# Altium project VCO.PrjPcb
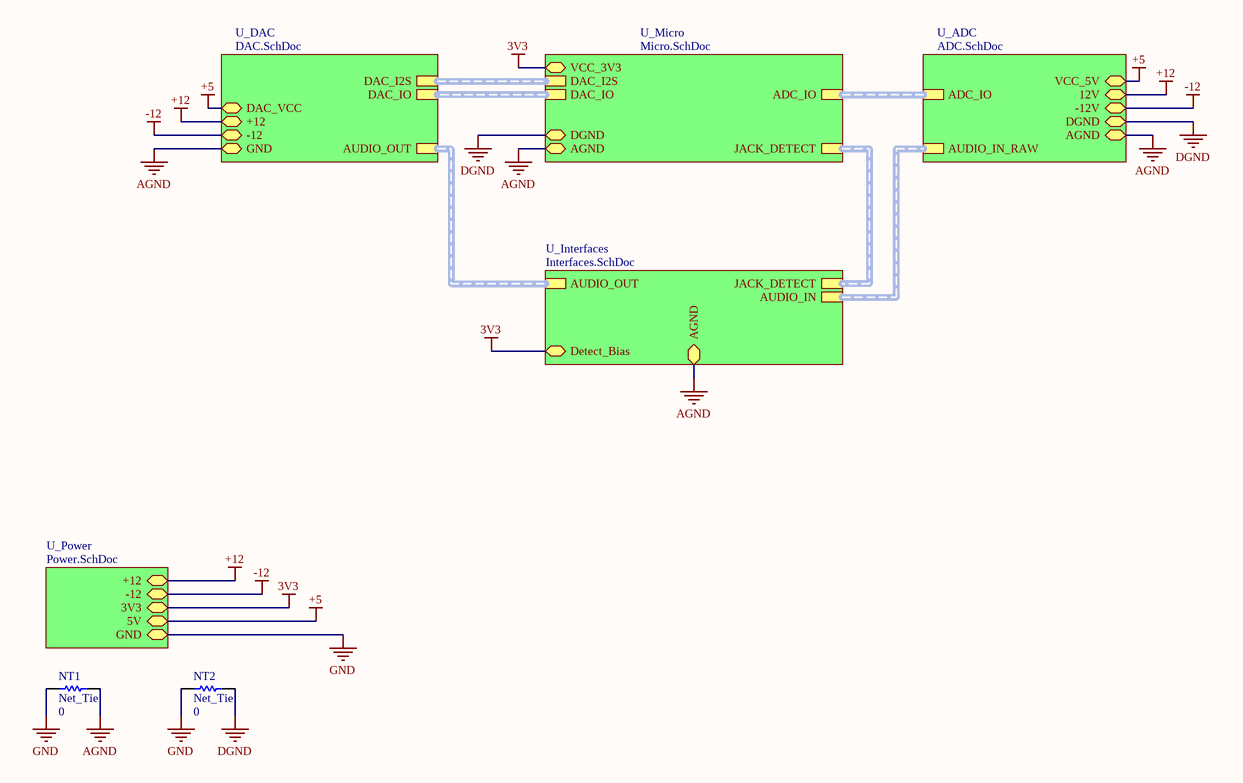
[diagram p0: VCO_TOP.SchDoc]
8 sheets, 148 parts. Net scope: strictly hierarchical (ports join the sheet entries above them; power ports are local).
Board file: VCO.PcbDoc
Sheets:
  VCO_TOP.SchDoc
    U_Power = Power.SchDoc
    U_Micro = Micro.SchDoc
    U_DAC = DAC.SchDoc
      U_Output_stages = Output_stages.SchDoc
    U_ADC = ADC.SchDoc
      U_Input_stages = Input_stages.SchDoc
    U_Interfaces = Interfaces.SchDoc

## Sheet VCO_TOP.SchDoc
size A4

### Parts
NT1  Net_Tie  value 0  [RES0603R]
NT2  Net_Tie  value 0  [RES0603R]

### Sub-sheets
U_ADC = ADC.SchDoc: AGND (bidir), VCC_5V (bidir), DGND (bidir), ADC_IO (harness ADC_IO), -12V (bidir), 12V (bidir), AUDIO_IN_RAW (harness AUDIO_IN)
U_DAC = DAC.SchDoc: DAC_I2S (harness DAC_I2S), DAC_VCC (bidir), GND (bidir), DAC_IO (harness DAC_IO), -12 (bidir), +12 (bidir), AUDIO_OUT (harness AUDIO_OUT)
U_Interfaces = Interfaces.SchDoc: AGND (bidir), Detect_Bias (bidir), JACK_DETECT (harness JACK_DETECT), AUDIO_OUT (harness AUDIO_OUT), AUDIO_IN (harness AUDIO_IN)
U_Micro = Micro.SchDoc: VCC_3V3 (bidir), DAC_I2S (harness DAC_I2S), DAC_IO (harness DAC_IO), JACK_DETECT (harness JACK_DETECT), ADC_IO (harness ADC_IO), DGND (bidir), AGND (bidir)
U_Power = Power.SchDoc: +12 (bidir), -12 (bidir), GND (bidir), 3V3 (bidir), 5V (bidir)

### Nets
3V3: sheet U_Power/3V3, sheet U_Micro/VCC_3V3, sheet U_Interfaces/Detect_Bias
+5: sheet U_Power/5V, sheet U_DAC/DAC_VCC, sheet U_ADC/VCC_5V
+12: sheet U_Power/+12, sheet U_DAC/+12, sheet U_ADC/12V
-12: sheet U_Power/-12, sheet U_DAC/-12, sheet U_ADC/-12V
AGND: NT1.2 ; sheet U_Micro/AGND, sheet U_DAC/GND, sheet U_ADC/AGND, sheet U_Interfaces/AGND
DGND: NT2.2 ; sheet U_Micro/DGND, sheet U_ADC/DGND
GND: NT1.1 NT2.1 ; sheet U_Power/GND

### Buses and harness runs
harness sheet U_ADC/ADC_IO = sheet U_Micro/ADC_IO
harness sheet U_ADC/AUDIO_IN_RAW = sheet U_Interfaces/AUDIO_IN
harness sheet U_DAC/AUDIO_OUT = sheet U_Interfaces/AUDIO_OUT
harness sheet U_DAC/DAC_I2S = sheet U_Micro/DAC_I2S
harness sheet U_DAC/DAC_IO = sheet U_Micro/DAC_IO
harness sheet U_Interfaces/JACK_DETECT = sheet U_Micro/JACK_DETECT

### Library data of the parts
NT1 NT2 = Res1: Resistor; Published: 8-Jun-2000; LatestRevisionDate: 17-Jul-2002; LatestRevisionNote: Re-released for DXP Platform.; PackageReference: AXIAL-0.3; Publisher: Altium Limited; PackageDescription: Axial Device, Thru-Hole; 2 Leads; 0.3 in Pin Spacing

## Sheet Power.SchDoc
size A4
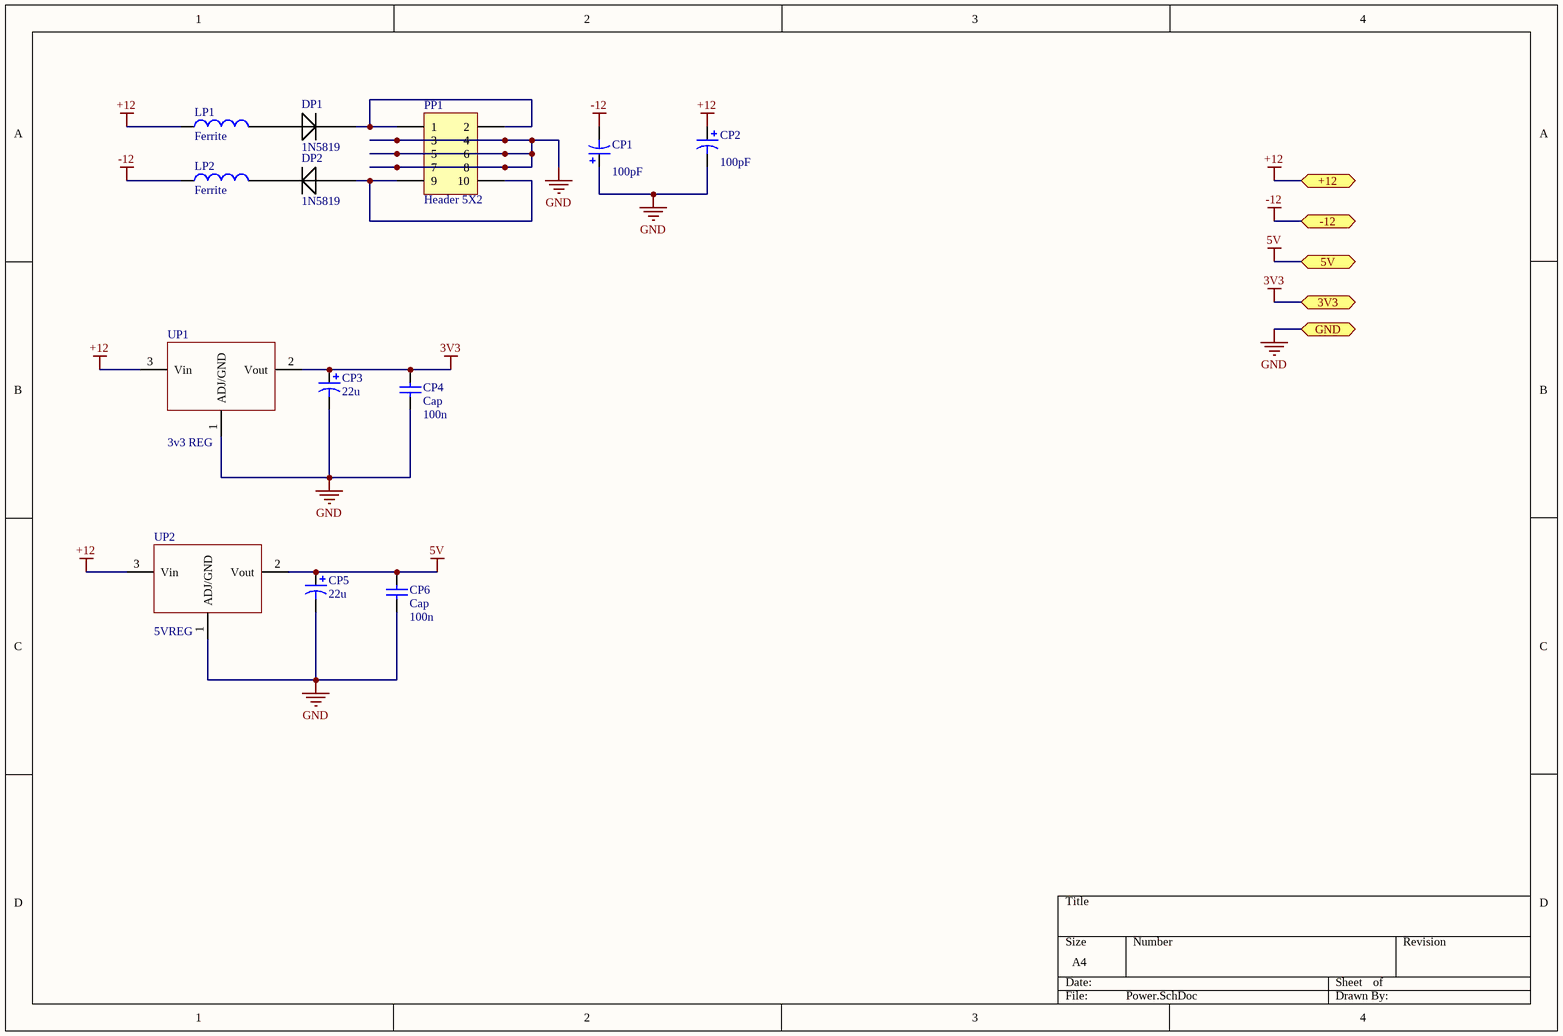
[diagram p1: Power.SchDoc]

### Parts
CP1  value 100pF  [C-RAD-4.5]  (hidden comment: Cap Pol2)
CP2  value 100pF  [C-RAD-4.5]  (hidden comment: Cap Pol2)
CP3  value 22u  [C 0603 / 1608]  (hidden comment: Cap Pol2)
CP4  Cap  value 100n  [C 0603 / 1608]
CP5  value 22u  [C 0603 / 1608]  (hidden comment: Cap Pol2)
CP6  Cap  value 100n  [C 0603 / 1608]
DP1  1N5819  [DO-41]
DP2  1N5819  [DO-41]
LP1  Ferrite  [RES0805R]
LP2  Ferrite  [RES0805R]
PP1  Header 5X2  [HDR2X5]
UP1  3v3 REG  [SOT-223-3 - REG]
UP2  5VREG  [SOT-223-3 - REG]

### Ports
3V3 (bidir), 5V (bidir), +12 (bidir), -12 (bidir), GND (bidir)

### Nets
3V3: CP3.1 CP4.2 UP1.2(Vout) ; port 3V3
5V: CP5.1 CP6.2 UP2.2(Vout) ; port 5V  [project net +5]
+12: CP2.1 LP1.1 UP1.3(Vin) UP2.3(Vin) ; port +12
-12: CP1.2 LP2.1 ; port -12
GND: CP1.1 CP2.2 CP3.2 CP4.1 CP5.2 CP6.1 PP1.3 PP1.4 PP1.5 PP1.6 PP1.7 PP1.8 UP1.1(ADJ/GND) UP2.1(ADJ/GND) ; port GND
NetDP1_1: DP1.1 PP1.1 PP1.2
NetDP1_2: DP1.2 LP1.2
NetDP2_1: DP2.1 LP2.2
NetDP2_2: DP2.2 PP1.9 PP1.10

### Library data of the parts
CP1-CP3 CP5 = Cap Pol2: Polarized Capacitor (Axial); Published: 8-Jun-2000; LatestRevisionDate: 17-Jul-2002; LatestRevisionNote: Re-released for DXP Platform.; PackageReference: POLAR0.8; Publisher: Altium Limited; PackageDescription: Polarized Capacitor; 2 Leads
CP4 CP6 = Cap: Capacitor; Published: 8-Jun-2000; LatestRevisionDate: 17-Jul-2002; LatestRevisionNote: Re-released for DXP Platform.; PackageReference: RAD-0.3; Publisher: Altium Limited; PackageDescription: Radial Cap, Thru-Hole; 2 Leads; 0.3 in Pin Spacing
DP1 DP2 = Diode
LP1 LP2 = Inductor: Code_IEC: 1005; Value: 10mH; Published: 8-Jun-2000; LatestRevisionDate: 29-May-2009; LatestRevisionNote: IPC-7351 Footprint Added.; PackageReference: 0402-A; Publisher: Altium Limited; PackageDescription: Chip Inductor; Code_JEITA: 0402
PP1 = Header 5X2: Header, 5-Pin, Dual row; LatestRevisionDate: 17-Jul-2002; LatestRevisionNote: Re-released for DXP Platform.; Publisher: Altium Limited
UP1 UP2 = AMS1117: LDO 3.3V/5V/12V

## Sheet Micro.SchDoc
size A4
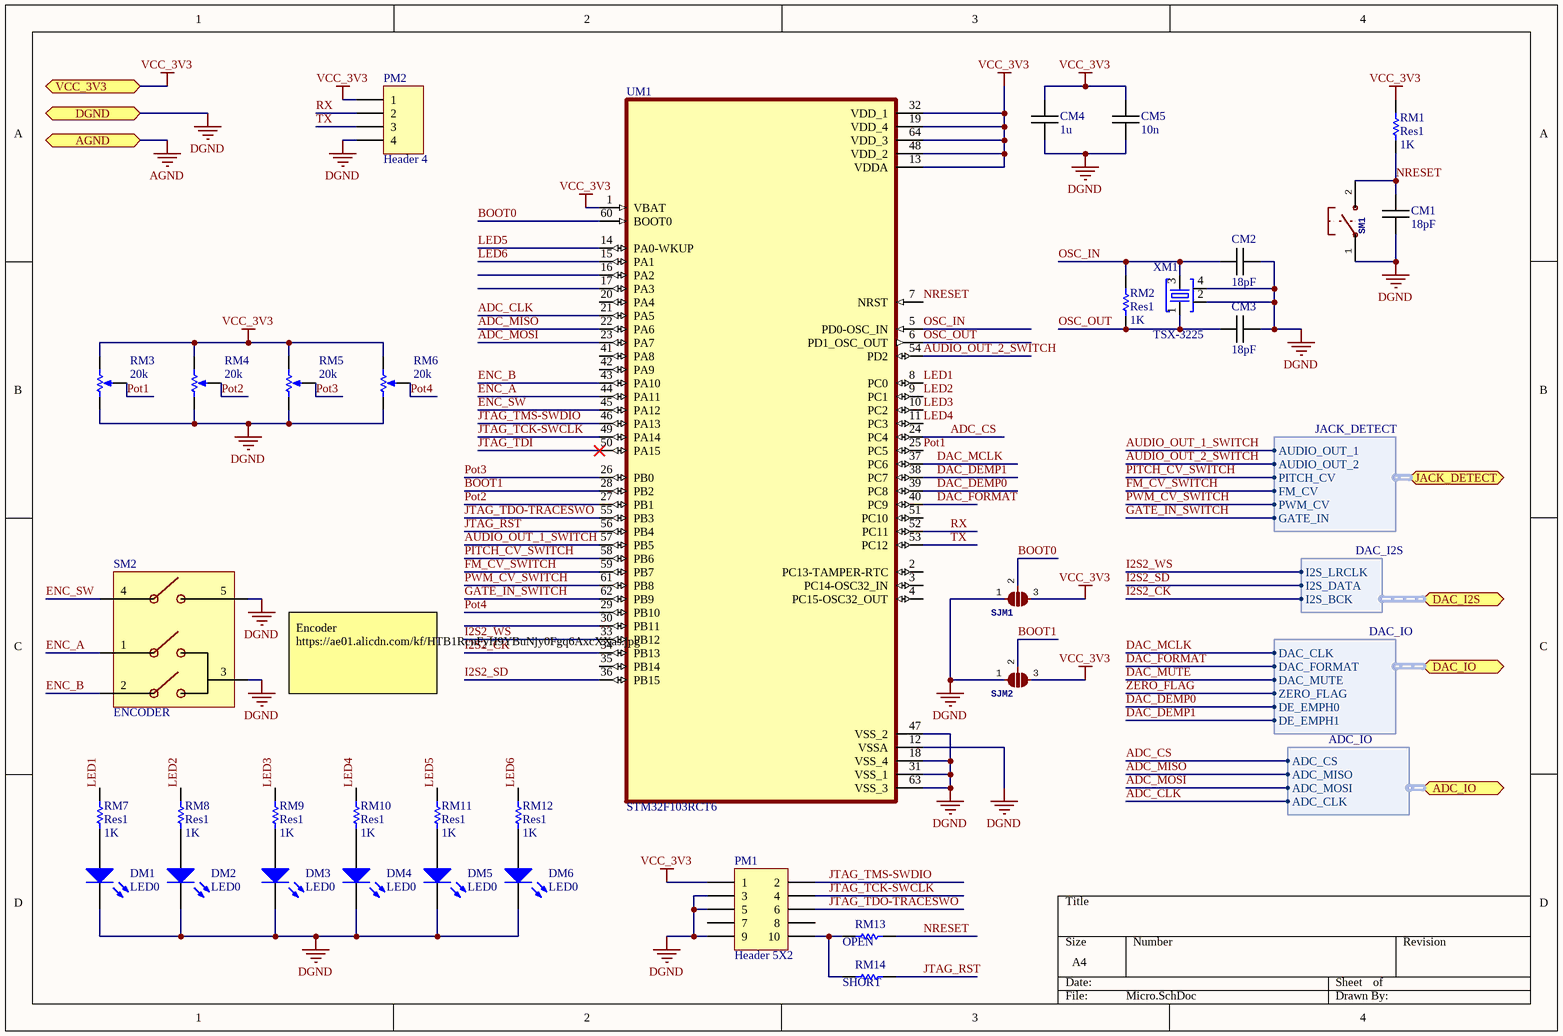
[diagram p2: Micro.SchDoc]

### Parts
CM1  18pF  [C 0603 / 1608]
CM2  18pF  [C 0603 / 1608]
CM3  18pF  [C 0603 / 1608]
CM4  1u  [C 0603 / 1608]
CM5  10n  [C 0603 / 1608]
DM1  LED0  [LED2-2.54-D5.0MM]
DM2  LED0  [LED2-2.54-D5.0MM]
DM3  LED0  [LED2-2.54-D5.0MM]
DM4  LED0  [LED2-2.54-D5.0MM]
DM5  LED0  [LED2-2.54-D5.0MM]
DM6  LED0  [LED2-2.54-D5.0MM]
PM1  Header 5X2  [HDR2X5]
PM2  Header 4  [HDR1X4]
RM1  Res1  value 1K  [RES0603R]
RM2  Res1  value 1K  [RES0603R]
RM3  value 20k  [POT-rv09]
RM4  value 20k  [POT-rv09]
RM5  value 20k  [POT-rv09]
RM6  value 20k  [POT-rv09]
RM7  Res1  value 1K  [RES0603R]
RM8  Res1  value 1K  [RES0603R]
RM9  Res1  value 1K  [RES0603R]
RM10  Res1  value 1K  [RES0603R]
RM11  Res1  value 1K  [RES0603R]
RM12  Res1  value 1K  [RES0603R]
RM13  value OPEN  [RES0603R]  (hidden comment: Res1)
RM14  value SHORT  [RES0603R]  (hidden comment: Res1)
SJM1  2-Way Solder Jumper  [SOLDERJUMPER_2WAY_OPEN_NOPASTE]  (value not drawn)
SJM2  2-Way Solder Jumper  [SOLDERJUMPER_2WAY_OPEN_NOPASTE]  (value not drawn)
SM1  Switch  [PUSH_SMD_3x4]  (value not drawn)
SM2  ENCODER  [Rotary Encoder]
UM1  STM32F103RCT6  [QFP64P1200X1200X160-64N]
XM1  TSX-3225  [TSX-3225]

### Ports
ADC_IO (bidir, harness ADC_IO), AGND (bidir), DAC_I2S (bidir, harness DAC_I2S), DAC_IO (bidir, harness DAC_IO), DGND (bidir), JACK_DETECT (bidir, harness JACK_DETECT), VCC_3V3 (bidir)

### Harnesses
DAC_I2S: I2S_LRCLK, I2S_DATA, I2S_BCK
DAC_IO: DAC_CLK, DAC_FORMAT, DAC_MUTE, ZERO_FLAG, DE_EMPH0, DE_EMPH1
JACK_DETECT: AUDIO_OUT_1, AUDIO_OUT_2, PITCH_CV, FM_CV, PWM_CV, GATE_IN
ADC_IO: ADC_CS, ADC_MISO, ADC_MOSI, ADC_CLK

### Nets
DGND: CM1.1 CM2.1 CM3.1 CM4.1 CM5.1 DM1.2(K) DM2.2(K) DM3.2(K) DM4.2(K) DM5.2(K) DM6.2(K) PM1.3 PM1.5 PM1.9 PM2.4 RM3.1(TOP) RM4.1(TOP) RM5.1(TOP) RM6.1(TOP) SJM1.1 SJM2.1 SM1.1(P$1) SM2.3(ROT_COMMON) SM2.5(SW_GND) UM1.12(VSSA) UM1.18(VSS_4) UM1.31(VSS_1) UM1.47(VSS_2) UM1.63(VSS_3) XM1.2 XM1.4 ; port DGND
VCC_3V3: CM4.2 CM5.2 PM1.1 PM2.1 RM1.1 RM3.2(BOT) RM4.2(BOT) RM5.2(BOT) RM6.2(BOT) SJM1.3 SJM2.3 UM1.1(VBAT) UM1.13(VDDA) UM1.19(VDD_4) UM1.32(VDD_1) UM1.48(VDD_2) UM1.64(VDD_3) ; port VCC_3V3  [project net 3V3]
ADC_CLK: UM1.21(PA5) ; port ADC_IO.ADC_CLK
ADC_CS: UM1.24(PC4) ; port ADC_IO.ADC_CS
ADC_MISO: UM1.22(PA6) ; port ADC_IO.ADC_MISO
ADC_MOSI: UM1.23(PA7) ; port ADC_IO.ADC_MOSI
AUDIO_OUT_1_SWITCH: UM1.57(PB5) ; port JACK_DETECT.AUDIO_OUT_1
AUDIO_OUT_2_SWITCH: UM1.54(PD2) ; port JACK_DETECT.AUDIO_OUT_2
BOOT0: SJM1.2 UM1.60(BOOT0)
BOOT1: SJM2.2 UM1.28(PB2)
DAC_DEMP0: UM1.39(PC8) ; port DAC_IO.DE_EMPH0
DAC_DEMP1: UM1.38(PC7) ; port DAC_IO.DE_EMPH1
DAC_FORMAT: UM1.40(PC9) ; port DAC_IO.DAC_FORMAT
DAC_MCLK: UM1.37(PC6) ; port DAC_IO.DAC_CLK  [project net DAC_CLK]
ENC_A: SM2.1 UM1.44(PA11)
ENC_B: SM2.2 UM1.43(PA10)
ENC_SW: SM2.4(SW) UM1.45(PA12)
FM_CV_SWITCH: UM1.59(PB7) ; port JACK_DETECT.FM_CV
GATE_IN_SWITCH: UM1.62(PB9) ; port JACK_DETECT.GATE_IN
I2S2_CK: UM1.34(PB13) ; port DAC_I2S.I2S_BCK
I2S2_SD: UM1.36(PB15) ; port DAC_I2S.I2S_DATA
I2S2_WS: UM1.33(PB12) ; port DAC_I2S.I2S_LRCLK
JTAG_RST: RM14.2 UM1.56(PB4)
JTAG_TCK-SWCLK: PM1.4 UM1.49(PA14)
JTAG_TDI: UM1.50(PA15)
JTAG_TDO-TRACESWO: PM1.6 UM1.55(PB3)
JTAG_TMS-SWDIO: PM1.2 UM1.46(PA13)
LED1: RM7.1 UM1.8(PC0)
LED2: RM8.1 UM1.9(PC1)
LED3: RM9.1 UM1.10(PC2)
LED4: RM10.1 UM1.11(PC3)
LED5: RM11.1 UM1.14(PA0-WKUP)
LED6: RM12.1 UM1.15(PA1)
NRESET: CM1.2 RM1.2 RM13.2 SM1.2(P$2) UM1.7(NRST)
OSC_IN: CM2.2 RM2.1 UM1.5(PD0-OSC_IN) XM1.3
OSC_OUT: CM3.2 RM2.2 UM1.6(PD1_OSC_OUT) XM1.1
PITCH_CV_SWITCH: UM1.58(PB6) ; port JACK_DETECT.PITCH_CV
Pot1: RM3.3(TAP) UM1.25(PC5)
Pot2: RM4.3(TAP) UM1.27(PB1)
Pot3: RM5.3(TAP) UM1.26(PB0)
Pot4: RM6.3(TAP) UM1.29(PB10)
PWM_CV_SWITCH: UM1.61(PB8) ; port JACK_DETECT.PWM_CV  [project net IN3_SWITCH]
RX: PM2.2 UM1.52(PC11)
TX: PM2.3 UM1.53(PC12)
NetDM1_1: DM1.1(A) RM7.2
NetDM2_1: DM2.1(A) RM8.2
NetDM3_1: DM3.1(A) RM9.2
NetDM4_1: DM4.1(A) RM10.2
NetDM5_1: DM5.1(A) RM11.2
NetDM6_1: DM6.1(A) RM12.2
NetPM1_10: PM1.10 RM13.1 RM14.1

Not connected (* = marked no-connect by the designer): PM1 7 8; UM1 2(PC13-TAMPER-RTC) 3(PC14-OSC32_IN) 4(PC15-OSC32_OUT) 16(PA2) 17(PA3) 20(PA4) 30(PB11) 35(PB14) 41(PA8) 42(PA9) 51(PC10)

### Notes on the sheet
- Encoder
  https://ae01.alicdn.com/kf/HTB1RcnFyH9YBuNjy0Fgq6AxcXXas.jpg

### Library data of the parts
CM1-CM5 = Capacitor: Value: asdasd
DM1-DM6 = LED0: Typical INFRARED GaAs LED; Published: 8-Jun-2000; LatestRevisionDate: 08-Jul-2005; LatestRevisionNote: Mech Layer 1 removed.; PackageReference: LED-0; Publisher: Altium Limited; PackageDescription: LED; 2 Leads
PM1 = Header 5X2: Header, 5-Pin, Dual row; LatestRevisionDate: 17-Jul-2002; LatestRevisionNote: Re-released for DXP Platform.; Publisher: Altium Limited
PM2 = Header 4: Header, 4-Pin; LatestRevisionDate: 17-Jul-2002; LatestRevisionNote: Re-released for DXP Platform.; Publisher: Altium Limited
RM1 RM2 RM7-RM14 = Res1: Resistor; Published: 8-Jun-2000; LatestRevisionDate: 17-Jul-2002; LatestRevisionNote: Re-released for DXP Platform.; PackageReference: AXIAL-0.3; Publisher: Altium Limited; PackageDescription: Axial Device, Thru-Hole; 2 Leads; 0.3 in Pin Spacing
RM3-RM6 = RPot: Potentiometer; Sim Note: Enter the Resistance value and the set point into parameter fields.; Set Position: 0.5; Published: 8-Jun-2000; LatestRevisionDate: 17-Jul-2002; LatestRevisionNote: Re-released for DXP Platform.; PackageReference: VR5; Publisher: Altium Limited; PackageDescription: Variable Resistor, Thru-Hole; 3 Leads
SJM1 SJM2 = SOLDERJUMPER_2WAY0603
SM1 = B3U-1000P: MANUFACTURER: Omron; DIGIKEY: SW1020CT-ND; MPN: B3U-1000P
UM1 = STM32F103RCT6: ARMÂ® CortexÂ®-M3 STM32F1 Microcontroller IC 32-Bit 72MHz 256KB _256K x 8_ FLASH; MF: STMicroelectronics; MP: STM32F103RCT6; Price: None; Package: LQFP-64 STMicroelectronics; Availability: Unavailable; SnapEDA_Link: https://www.snapeda.com/parts/STM32F103RCT6/STMicroelectronics/view-part/44152/?ref=snap; Value: *
XM1 = TSX-3225: 16MHz Â±10ppm Crystal 9pF 60 Ohms 4-SMD, No Lead; MF: EPSON; Package: SMD-4 Epson; Price: None; SnapEDA_Link: https://www.snapeda.com/parts/TSX-3225/EPSON/view-part/557780/?ref=snap; Availability: Unavailable; Value: *; MP: TSX-3225

## Sheet DAC.SchDoc
size A4
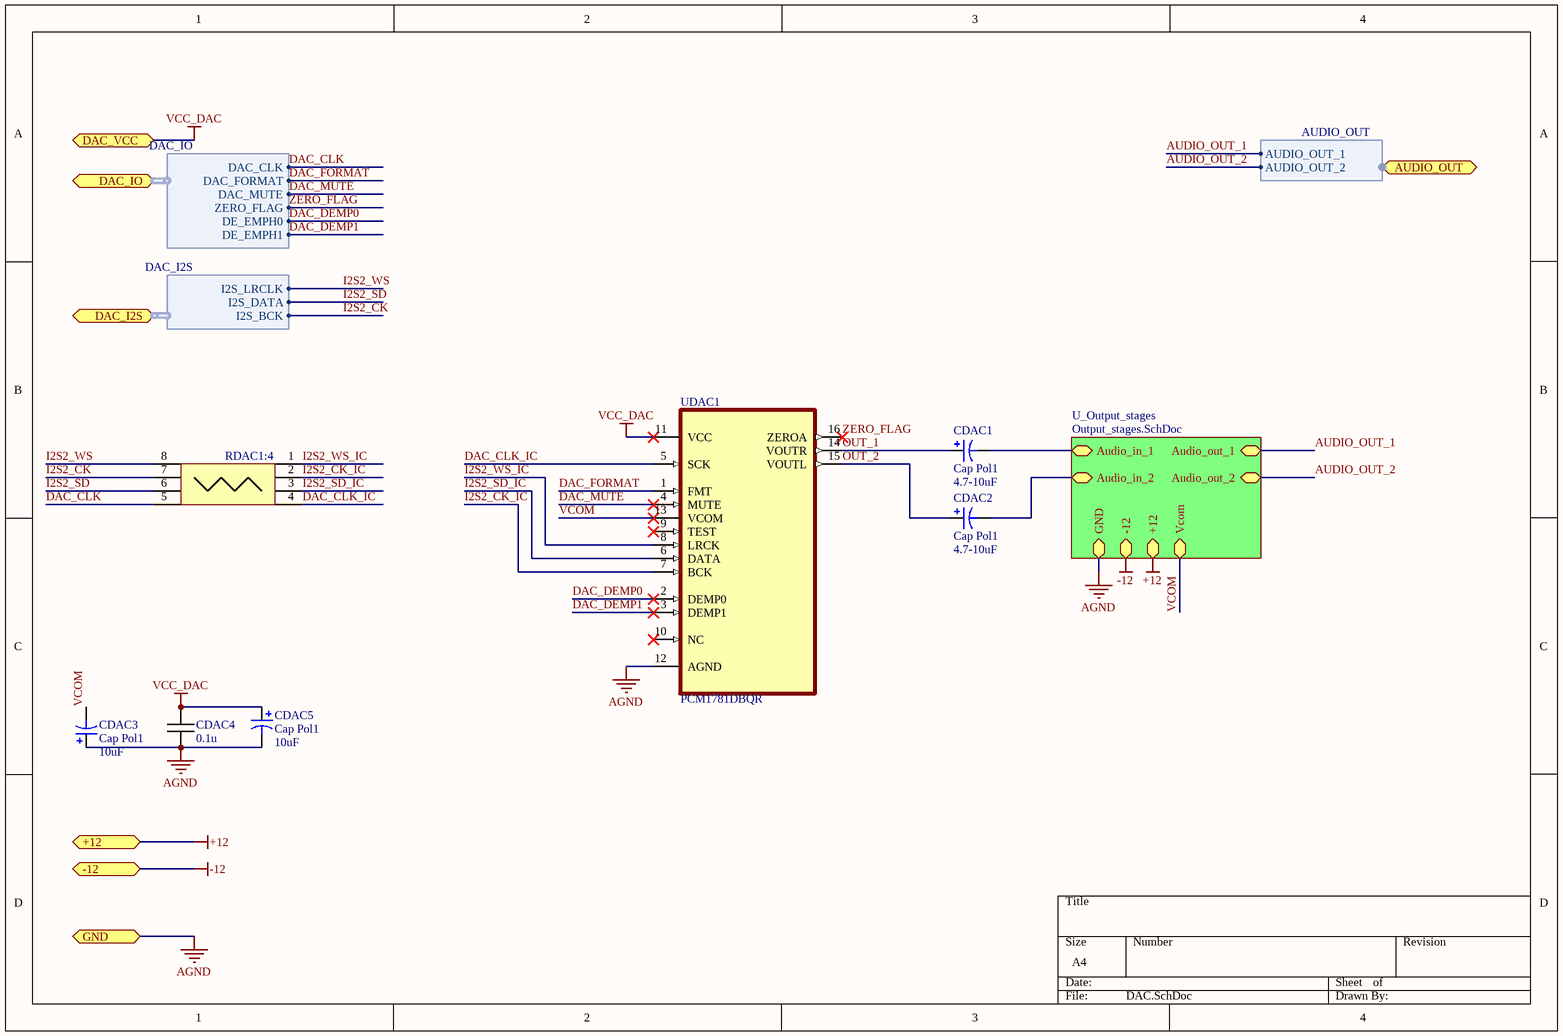
[diagram p3: DAC.SchDoc]

### Parts
CDAC1  Cap Pol1  value 4.7-10uF  [C-RAD-4.5]
CDAC2  Cap Pol1  value 4.7-10uF  [C-RAD-4.5]
CDAC3  Cap Pol1  value 10uF  [C-RAD-4.5]
CDAC4  0.1u  [C 0603 / 1608]
CDAC5  Cap Pol1  value 10uF  [C-RAD-4.5]
RDAC1:4  742C083121JP  [RESARRAY(4x0603)]  (value not drawn)
UDAC1  PCM1781DBQR  [SOP16-63P600X175-16N]

### Sub-sheets
U_Output_stages = Output_stages.SchDoc: GND (bidir), -12 (bidir), +12 (bidir), Audio_in_1 (bidir), Audio_in_2 (bidir), Vcom (bidir), Audio_out_1 (bidir), Audio_out_2 (bidir)

### Ports
+12 (bidir), -12 (bidir), AUDIO_OUT (bidir, harness AUDIO_OUT), DAC_I2S (bidir, harness DAC_I2S), DAC_IO (bidir, harness DAC_IO), DAC_VCC (bidir), GND (bidir)

### Harnesses
DAC_IO: DAC_CLK, DAC_FORMAT, DAC_MUTE, ZERO_FLAG, DE_EMPH0, DE_EMPH1
AUDIO_OUT: AUDIO_OUT_1, AUDIO_OUT_2
DAC_I2S: I2S_LRCLK, I2S_DATA, I2S_BCK

### Nets
+12: port +12, sheet U_Output_stages/+12
-12: port -12, sheet U_Output_stages/-12
AGND: CDAC3.1 CDAC4.2 CDAC5.2 UDAC1.12(AGND) ; port GND, sheet U_Output_stages/GND
VCC_DAC: CDAC4.1 CDAC5.1 UDAC1.11(VCC) ; port DAC_VCC  [project net +5]
AUDIO_OUT_1: sheet U_Output_stages/Audio_out_1, port AUDIO_OUT.AUDIO_OUT_1
AUDIO_OUT_2: sheet U_Output_stages/Audio_out_2, port AUDIO_OUT.AUDIO_OUT_2
DAC_CLK: RDAC1:4.5 ; port DAC_IO.DAC_CLK
DAC_CLK_IC: RDAC1:4.4 UDAC1.5(SCK)
DAC_DEMP0: UDAC1.2(DEMP0) ; port DAC_IO.DE_EMPH0
DAC_DEMP1: UDAC1.3(DEMP1) ; port DAC_IO.DE_EMPH1
DAC_FORMAT: UDAC1.1(FMT) ; port DAC_IO.DAC_FORMAT
DAC_MUTE: UDAC1.4(MUTE) ; port DAC_IO.DAC_MUTE
I2S2_CK: RDAC1:4.7 ; port DAC_I2S.I2S_BCK
I2S2_CK_IC: RDAC1:4.2 UDAC1.7(BCK)
I2S2_SD: RDAC1:4.6 ; port DAC_I2S.I2S_DATA
I2S2_SD_IC: RDAC1:4.3 UDAC1.6(DATA)
I2S2_WS: RDAC1:4.8 ; port DAC_I2S.I2S_LRCLK
I2S2_WS_IC: RDAC1:4.1 UDAC1.8(LRCK)
OUT_1: CDAC1.1 UDAC1.14(VOUTR)
OUT_2: CDAC2.1 UDAC1.15(VOUTL)
VCOM: CDAC3.2 UDAC1.13(VCOM) ; sheet U_Output_stages/Vcom
ZERO_FLAG: UDAC1.16(ZEROA) ; port DAC_IO.ZERO_FLAG
NetCDAC1_2: CDAC1.2 ; sheet U_Output_stages/Audio_in_1
NetCDAC2_2: CDAC2.2 ; sheet U_Output_stages/Audio_in_2

Not connected (* = marked no-connect by the designer): UDAC1 9(TEST)* 10(NC)*

### Library data of the parts
CDAC1-CDAC3 CDAC5 = Cap Pol1: Polarized Capacitor (Radial); Published: 8-Jun-2000; LatestRevisionDate: 17-Jul-2002; LatestRevisionNote: Re-released for DXP Platform.; PackageReference: RB7.6-15; Publisher: Altium Limited; PackageDescription: Polarized Capacitor (Radial); 2 Leads
CDAC4 = Capacitor: Value: asdasd
RDAC1:4 = Resistor Array 4x: Res Thick Film Array 120 Ohm 5% 1/4W Â±200ppm/Â°C ISOL Molded 8-Pin 1206_4 X 0603_ Concave SMD Paper T/R; MF: CTS Resistor; Availability: Unavailable; SnapEDA_Link: https://www.snapeda.com/parts/742C083121JP/CTS%20Resistor%20Products/view-part/?ref=snap; Price: None; Package: 1206 CTS Components; MP: 742C083121JP; Value: *
UDAC1 = PCM1781DBQR: Converters - Digital to Analog _DAC_ 24-Bit, 192kHz, Ster Delta-Sig Audio DAC; MF: Texas Instruments; Price: None; Value: *; Package: SSOP-16 Texas Instruments; SnapEDA_Link: https://www.snapeda.com/parts/PCM1781DBQR/Texas%20Instruments/view-part/547789/?ref=snap; MP: PCM1781DBQR; Availability: Unavailable

## Sheet Output_stages.SchDoc
size A4
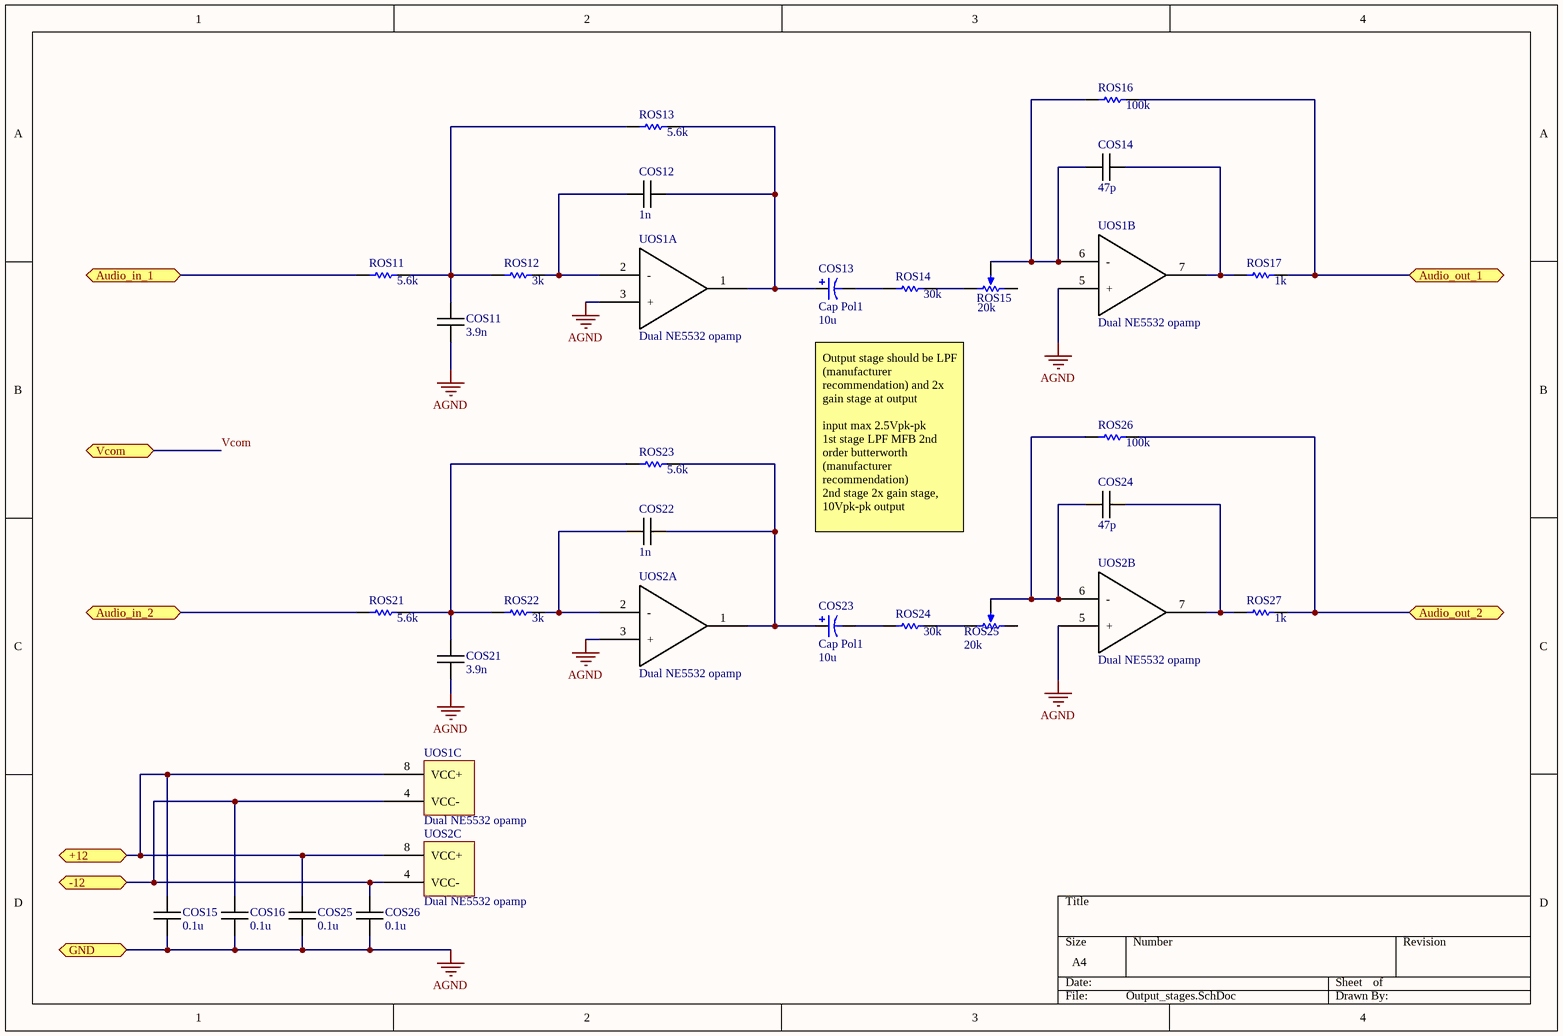
[diagram p4: Output_stages.SchDoc]

### Parts
COS11  3.9n  [C 0603 / 1608]
COS12  1n  [C 0603 / 1608]
COS13  Cap Pol1  value 10u  [RB7.6-15]
COS14  47p  [C 0603 / 1608]
COS15  0.1u  [C 0603 / 1608]
COS16  0.1u  [C 0603 / 1608]
COS21  3.9n  [C 0603 / 1608]
COS22  1n  [C 0603 / 1608]
COS23  Cap Pol1  value 10u  [RB7.6-15]
COS24  47p  [C 0603 / 1608]
COS25  0.1u  [C 0603 / 1608]
COS26  0.1u  [C 0603 / 1608]
ROS11  value 5.6k  [RES0603R]
ROS12  value 3k  [RES0603R]
ROS13  value 5.6k  [RES0603R]
ROS14  value 30k  [RES0603R]
ROS15  value 20k  [SMD_POT_3x3mm]
ROS16  value 100k  [RES0603R]
ROS17  value 1k  [RES0603R]
ROS21  value 5.6k  [RES0603R]
ROS22  value 3k  [RES0603R]
ROS23  value 5.6k  [RES0603R]
ROS24  value 30k  [RES0603R]
ROS25  value 20k  [SMD_POT_3x3mm]
ROS26  value 100k  [RES0603R]
ROS27  value 1k  [RES0603R]
UOS1  Dual NE5532 opamp  (parts A,B,C of 3)
UOS2  Dual NE5532 opamp  (parts A,B,C of 3)

### Ports
+12 (bidir), -12 (bidir), Audio_in_1 (bidir), Audio_in_2 (bidir), Audio_out_1 (bidir), Audio_out_2 (bidir), GND (bidir), Vcom (bidir)

### Nets
+12: COS15.2 COS25.2 UOS1.8(VCC+) UOS2.8(VCC+) ; port +12
-12: COS16.2 COS26.2 UOS1.4(VCC-) UOS2.4(VCC-) ; port -12
AGND: COS11.1 COS15.1 COS16.1 COS21.1 COS25.1 COS26.1 UOS1.3(+) UOS1.5(+) UOS2.3(+) UOS2.5(+) ; port GND
AUDIO_OUT_1: ROS16.2 ROS17.2 ; port Audio_out_1
AUDIO_OUT_2: ROS26.2 ROS27.2 ; port Audio_out_2
NetCDAC1_2: ROS11.1 ; port Audio_in_1
NetCDAC2_2: ROS21.1 ; port Audio_in_2
NetCOS11_2: COS11.2 ROS11.2 ROS12.1 ROS13.1
NetCOS12_1: COS12.1 ROS12.2 UOS1.2(-)
NetCOS12_2: COS12.2 COS13.1 ROS13.2 UOS1.1(OUT)
NetCOS13_2: COS13.2 ROS14.1
NetCOS14_1: COS14.1 ROS15.3(TAP) ROS16.1 UOS1.6(-)
NetCOS14_2: COS14.2 ROS17.1 UOS1.7(OUT)
NetCOS21_2: COS21.2 ROS21.2 ROS22.1 ROS23.1
NetCOS22_1: COS22.1 ROS22.2 UOS2.2(-)
NetCOS22_2: COS22.2 COS23.1 ROS23.2 UOS2.1(OUT)
NetCOS23_2: COS23.2 ROS24.1
NetCOS24_1: COS24.1 ROS25.3(TAP) ROS26.1 UOS2.6(-)
NetCOS24_2: COS24.2 ROS27.1 UOS2.7(OUT)
NetROS14_2: ROS14.2 ROS15.2(BOT)
NetROS24_2: ROS24.2 ROS25.2(BOT)

Not connected (* = marked no-connect by the designer): ROS15 1(TOP); ROS25 1(TOP)

### Notes on the sheet
- Output stage should be LPF (manufacturer recommendation) and 2x gain stage at output
  input max 2.5Vpk-pk
  1st stage LPF MFB 2nd order butterworth (manufacturer recommendation)
  2nd stage 2x gain stage, 10Vpk-pk output

### Library data of the parts
COS11 COS12 COS14-COS16 COS21 COS22 COS24-COS26 = Capacitor: Value: asdasd
COS13 COS23 = Cap Pol1: Polarized Capacitor (Radial); Published: 8-Jun-2000; LatestRevisionDate: 17-Jul-2002; LatestRevisionNote: Re-released for DXP Platform.; PackageReference: RB7.6-15; Publisher: Altium Limited; PackageDescription: Polarized Capacitor (Radial); 2 Leads
ROS11-ROS14 ROS16 ROS17 ROS21-ROS24 ROS26 ROS27 = Res1: Resistor; Published: 8-Jun-2000; LatestRevisionDate: 17-Jul-2002; LatestRevisionNote: Re-released for DXP Platform.; PackageReference: AXIAL-0.3; Publisher: Altium Limited; PackageDescription: Axial Device, Thru-Hole; 2 Leads; 0.3 in Pin Spacing
ROS15 ROS25 = RPot: as RM3 on sheet Micro; Published: 8-Jun-2000; LatestRevisionDate: 17-Jul-2002; LatestRevisionNote: Re-released for DXP Platform.; PackageReference: VR5; Publisher: Altium Limited; PackageDescription: Variable Resistor, Thru-Hole; 3 Leads
UOS1 UOS2 = NE5532

## Sheet ADC.SchDoc
size A4
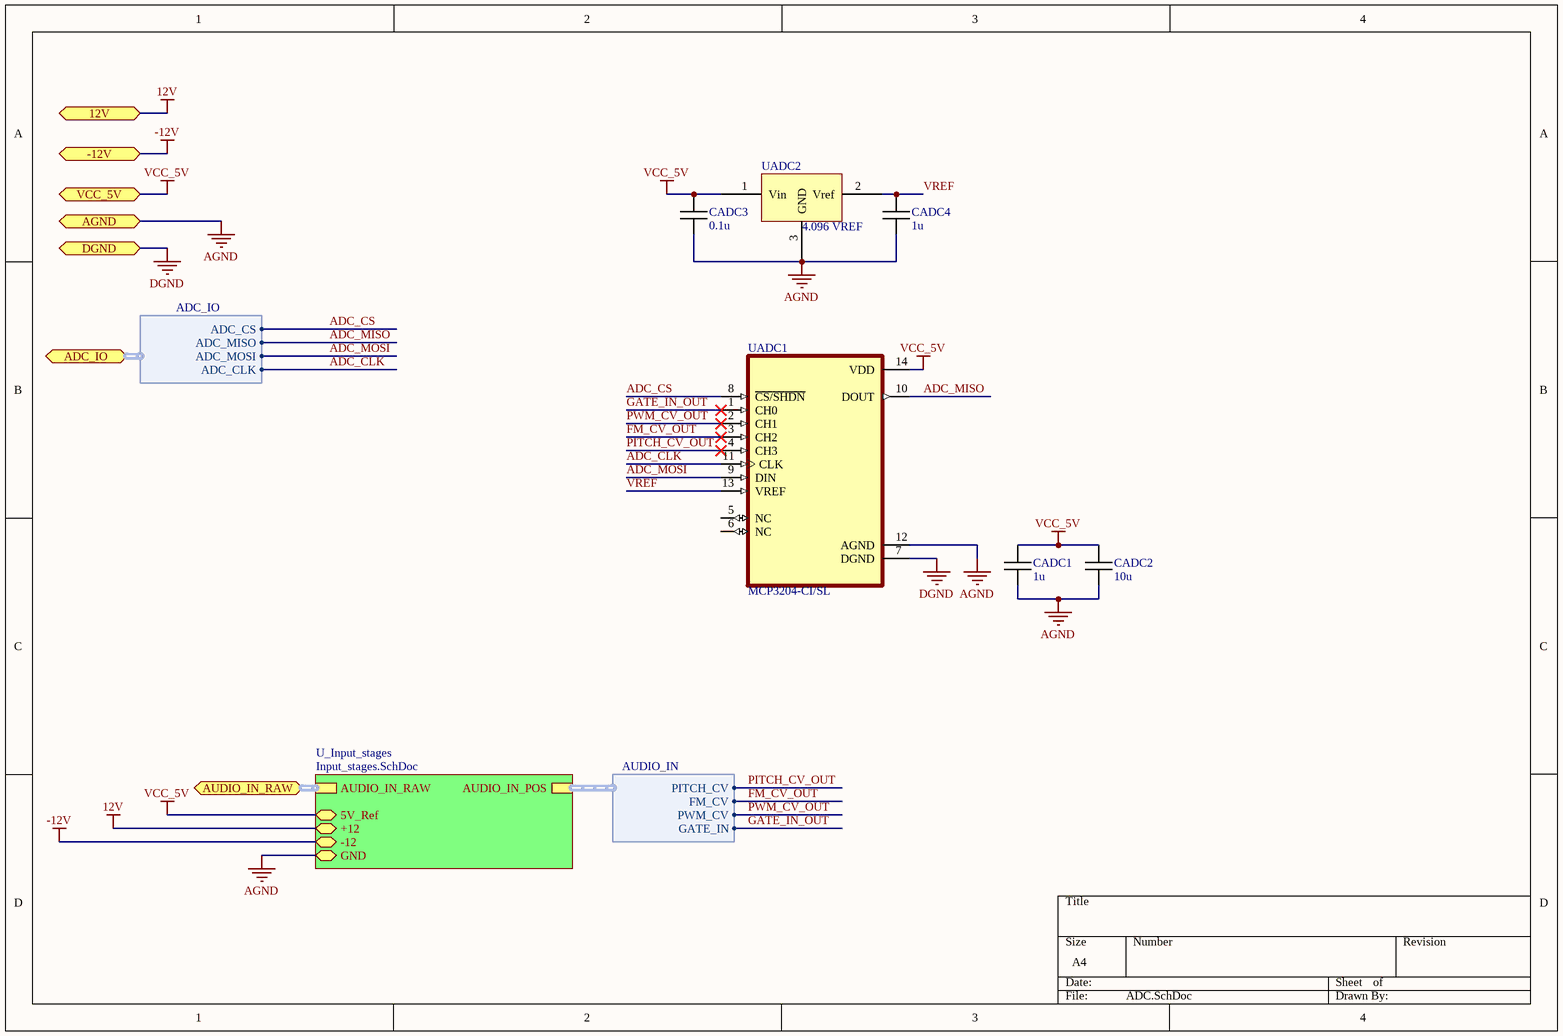
[diagram p5: ADC.SchDoc]

### Parts
CADC1  1u  [C 0603 / 1608]
CADC2  10u  [C 0603 / 1608]
CADC3  0.1u  [C 0603 / 1608]
CADC4  1u  [C 0603 / 1608]
UADC1  MCP3204-CI/SL  [SOIC-14]
UADC2  4.096 VREF  [SOT-23-3]

### Sub-sheets
U_Input_stages = Input_stages.SchDoc: GND (bidir), -12 (bidir), +12 (bidir), 5V_Ref (bidir), AUDIO_IN_POS (harness AUDIO_IN), AUDIO_IN_RAW (harness AUDIO_IN)

### Ports
12V (bidir), -12V (bidir), ADC_IO (bidir, harness ADC_IO), AGND (bidir), AUDIO_IN_RAW (bidir, harness AUDIO_IN), DGND (bidir), VCC_5V (bidir)

### Harnesses
ADC_IO: ADC_CS, ADC_MISO, ADC_MOSI, ADC_CLK
AUDIO_IN: PITCH_CV, FM_CV, PWM_CV, GATE_IN

### Nets
12V: port 12V, sheet U_Input_stages/+12  [project net +12]
-12V: port -12V, sheet U_Input_stages/-12  [project net -12]
AGND: CADC1.2 CADC2.2 CADC3.2 CADC4.2 UADC1.12(AGND) UADC2.3(GND) ; port AGND, sheet U_Input_stages/GND
DGND: UADC1.7(DGND) ; port DGND
VCC_5V: CADC1.1 CADC2.1 CADC3.1 UADC1.14(VDD) UADC2.1(Vin) ; port VCC_5V, sheet U_Input_stages/5V_Ref  [project net +5]
ADC_CLK: UADC1.11(CLK) ; port ADC_IO.ADC_CLK
ADC_CS: UADC1.8(~{CS/SHDN}) ; port ADC_IO.ADC_CS
ADC_MISO: UADC1.10(DOUT) ; port ADC_IO.ADC_MISO
ADC_MOSI: UADC1.9(DIN) ; port ADC_IO.ADC_MOSI
FM_CV_OUT: UADC1.3(CH2) ; sheet U_Input_stages/AUDIO_IN_POS.FM_CV
GATE_IN_OUT: UADC1.1(CH0) ; sheet U_Input_stages/AUDIO_IN_POS.GATE_IN
PITCH_CV_OUT: UADC1.4(CH3) ; sheet U_Input_stages/AUDIO_IN_POS.PITCH_CV
PWM_CV_OUT: UADC1.2(CH1) ; sheet U_Input_stages/AUDIO_IN_POS.PWM_CV
VREF: CADC4.1 UADC1.13(VREF) UADC2.2(Vref)

Not connected (* = marked no-connect by the designer): UADC1 5(NC) 6(NC)

### Buses and harness runs
harness port AUDIO_IN_RAW = sheet U_Input_stages/AUDIO_IN_RAW

### Library data of the parts
CADC1-CADC4 = Capacitor: Value: asdasd
UADC1 = MCP3204-CI/SL: 12 Bit Analog to Digital Converter 2, 4 Input 1 SAR 14-SOIC; MF: Microchip; Price: None; SnapEDA_Link: https://www.snapeda.com/parts/MCP3204-CI/SL/Microchip/view-part/62/?ref=snap; Value: *; Package: SOIC-14 Microchip; Availability: Unavailable; MP: MCP3204-CI/SL
UADC2 = MCP1541: 4.096 Voltage reference

## Sheet Input_stages.SchDoc
size A4
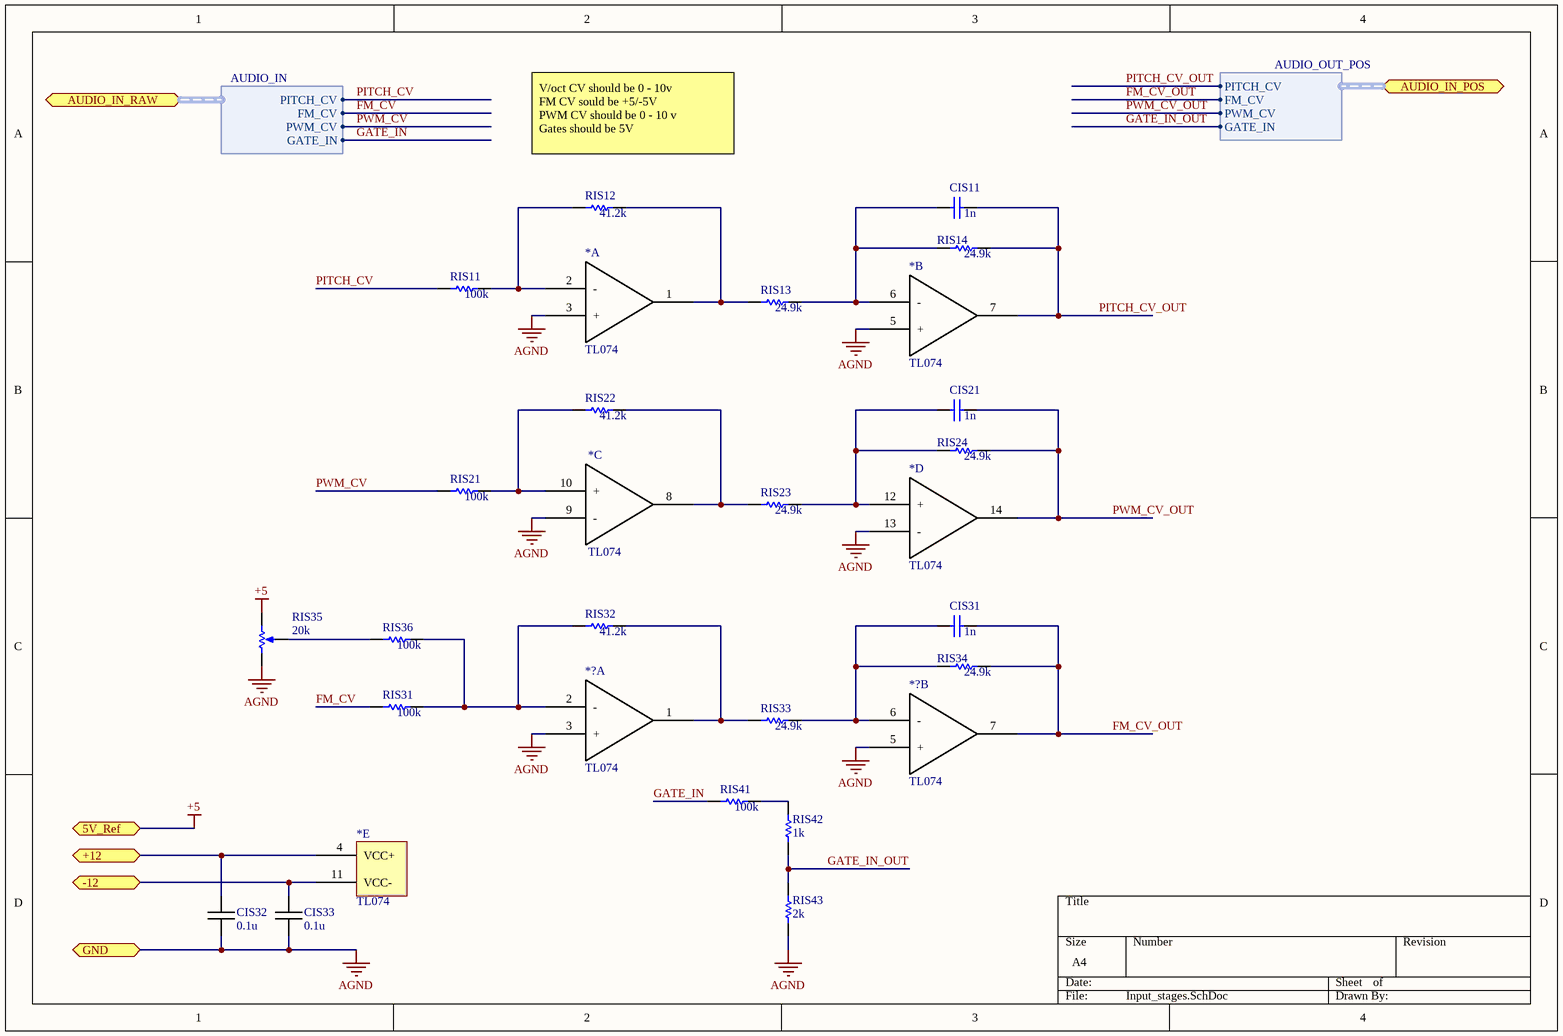
[diagram p6: Input_stages.SchDoc]

### Parts
(Parts that share a designator on the sheet are numbered #1, #2 ... from top to bottom, then left to right.)
*#1  TL074  [DIP-14]  (part A of 5)
*#2  TL074  [DIP-14]  (part B of 5)
*#3  TL074  [DIP-14]  (part C of 5)
*#4  TL074  [DIP-14]  (part D of 5)
*#5  TL074  [DIP-14]  (part E of 5)
*?#1  TL074  [DIP-14]  (part A of 5)
*?#2  TL074  [DIP-14]  (part B of 5)
CIS11  value 1n  [C 0603 / 1608]  (hidden comment: Cap)
CIS21  value 1n  [C 0603 / 1608]  (hidden comment: Cap)
CIS31  value 1n  [C 0603 / 1608]  (hidden comment: Cap)
CIS32  0.1u  [C 0603 / 1608]
CIS33  0.1u  [C 0603 / 1608]
RIS11  value 100k  [RES0603R]  (hidden comment: Res1)
RIS12  value 41.2k  [RES0603R]  (hidden comment: Res1)
RIS13  value 24.9k  [RES0603R]  (hidden comment: Res1)
RIS14  value 24.9k  [RES0603R]  (hidden comment: Res1)
RIS21  value 100k  [RES0603R]  (hidden comment: Res1)
RIS22  value 41.2k  [RES0603R]  (hidden comment: Res1)
RIS23  value 24.9k  [RES0603R]  (hidden comment: Res1)
RIS24  value 24.9k  [RES0603R]  (hidden comment: Res1)
RIS31  value 100k  [RES0603R]  (hidden comment: Res1)
RIS32  value 41.2k  [RES0603R]  (hidden comment: Res1)
RIS33  value 24.9k  [RES0603R]  (hidden comment: Res1)
RIS34  value 24.9k  [RES0603R]  (hidden comment: Res1)
RIS35  value 20k  [SMD_POT_3x3mm]
RIS36  value 100k  [RES0603R]  (hidden comment: Res1)
RIS41  value 100k  [RES0603R]  (hidden comment: Res1)
RIS42  value 1k  [RES0603R]  (hidden comment: Res1)
RIS43  value 2k  [RES0603R]  (hidden comment: Res1)

### Ports
5V_Ref (bidir), +12 (bidir), -12 (bidir), AUDIO_IN_POS (bidir, harness AUDIO_OUT_POS), AUDIO_IN_RAW (bidir, harness AUDIO_IN), GND (bidir)

### Harnesses
AUDIO_IN: PITCH_CV, FM_CV, PWM_CV, GATE_IN
AUDIO_OUT_POS: PITCH_CV, FM_CV, PWM_CV, GATE_IN

### Nets
+5: RIS35.2(BOT) ; port 5V_Ref
+12: *#5.4(VCC+) CIS32.2 ; port +12
-12: *#5.11(VCC-) CIS33.2 ; port -12
AGND: *#1.3(+) *#2.5(+) *#3.9(-) *#4.13(-) *?#1.3(+) *?#2.5(+) CIS32.1 CIS33.1 RIS35.1(TOP) RIS43.1 ; port GND
FM_CV: RIS31.1 ; port AUDIO_IN_RAW.FM_CV
FM_CV_OUT: *?#2.7(OUT) CIS31.2 RIS34.2 ; port AUDIO_IN_POS.FM_CV
GATE_IN: RIS41.1 ; port AUDIO_IN_RAW.GATE_IN
GATE_IN_OUT: RIS42.1 RIS43.2 ; port AUDIO_IN_POS.GATE_IN
PITCH_CV: RIS11.1 ; port AUDIO_IN_RAW.PITCH_CV
PITCH_CV_OUT: *#2.7(OUT) CIS11.2 RIS14.2 ; port AUDIO_IN_POS.PITCH_CV
PWM_CV: RIS21.1 ; port AUDIO_IN_RAW.PWM_CV  [project net IN3]
PWM_CV_OUT: *#4.14(OUT) CIS21.2 RIS24.2 ; port AUDIO_IN_POS.PWM_CV
Net*#1_1: *#1.1(OUT) RIS12.2 RIS13.1
Net*#1_2: *#1.2(-) RIS11.2 RIS12.1
Net*#2_6: *#2.6(-) CIS11.1 RIS13.2 RIS14.1
Net*#3_8: *#3.8(OUT) RIS22.2 RIS23.1
Net*#3_10: *#3.10(+) RIS21.2 RIS22.1
Net*#4_12: *#4.12(+) CIS21.1 RIS23.2 RIS24.1
Net*?#1_1: *?#1.1(OUT) RIS32.2 RIS33.1
Net*?#1_2: *?#1.2(-) RIS31.2 RIS32.1 RIS36.2
Net*?#2_6: *?#2.6(-) CIS31.1 RIS33.2 RIS34.1
NetRIS35_3: RIS35.3(TAP) RIS36.1
NetRIS41_2: RIS41.2 RIS42.2

### Notes on the sheet
- V/oct CV should be 0 - 10v
  FM CV sould be +5/-5V
  PWM CV should be 0 - 10 v
  Gates should be 5V

### Library data of the parts
CIS11 CIS21 CIS31 = Cap: Capacitor; Published: 8-Jun-2000; LatestRevisionDate: 17-Jul-2002; LatestRevisionNote: Re-released for DXP Platform.; PackageReference: RAD-0.3; Publisher: Altium Limited; PackageDescription: Radial Cap, Thru-Hole; 2 Leads; 0.3 in Pin Spacing
CIS32 CIS33 = Capacitor: Value: asdasd
RIS11-RIS14 RIS21-RIS24 RIS31-RIS34 RIS36 RIS41-RIS43 = Res1: Resistor; Published: 8-Jun-2000; LatestRevisionDate: 17-Jul-2002; LatestRevisionNote: Re-released for DXP Platform.; PackageReference: AXIAL-0.3; Publisher: Altium Limited; PackageDescription: Axial Device, Thru-Hole; 2 Leads; 0.3 in Pin Spacing
RIS35 = RPot: as RM3 on sheet Micro; Published: 8-Jun-2000; LatestRevisionDate: 17-Jul-2002; LatestRevisionNote: Re-released for DXP Platform.; PackageReference: VR5; Publisher: Altium Limited; PackageDescription: Variable Resistor, Thru-Hole; 3 Leads

## Sheet Interfaces.SchDoc
size A4
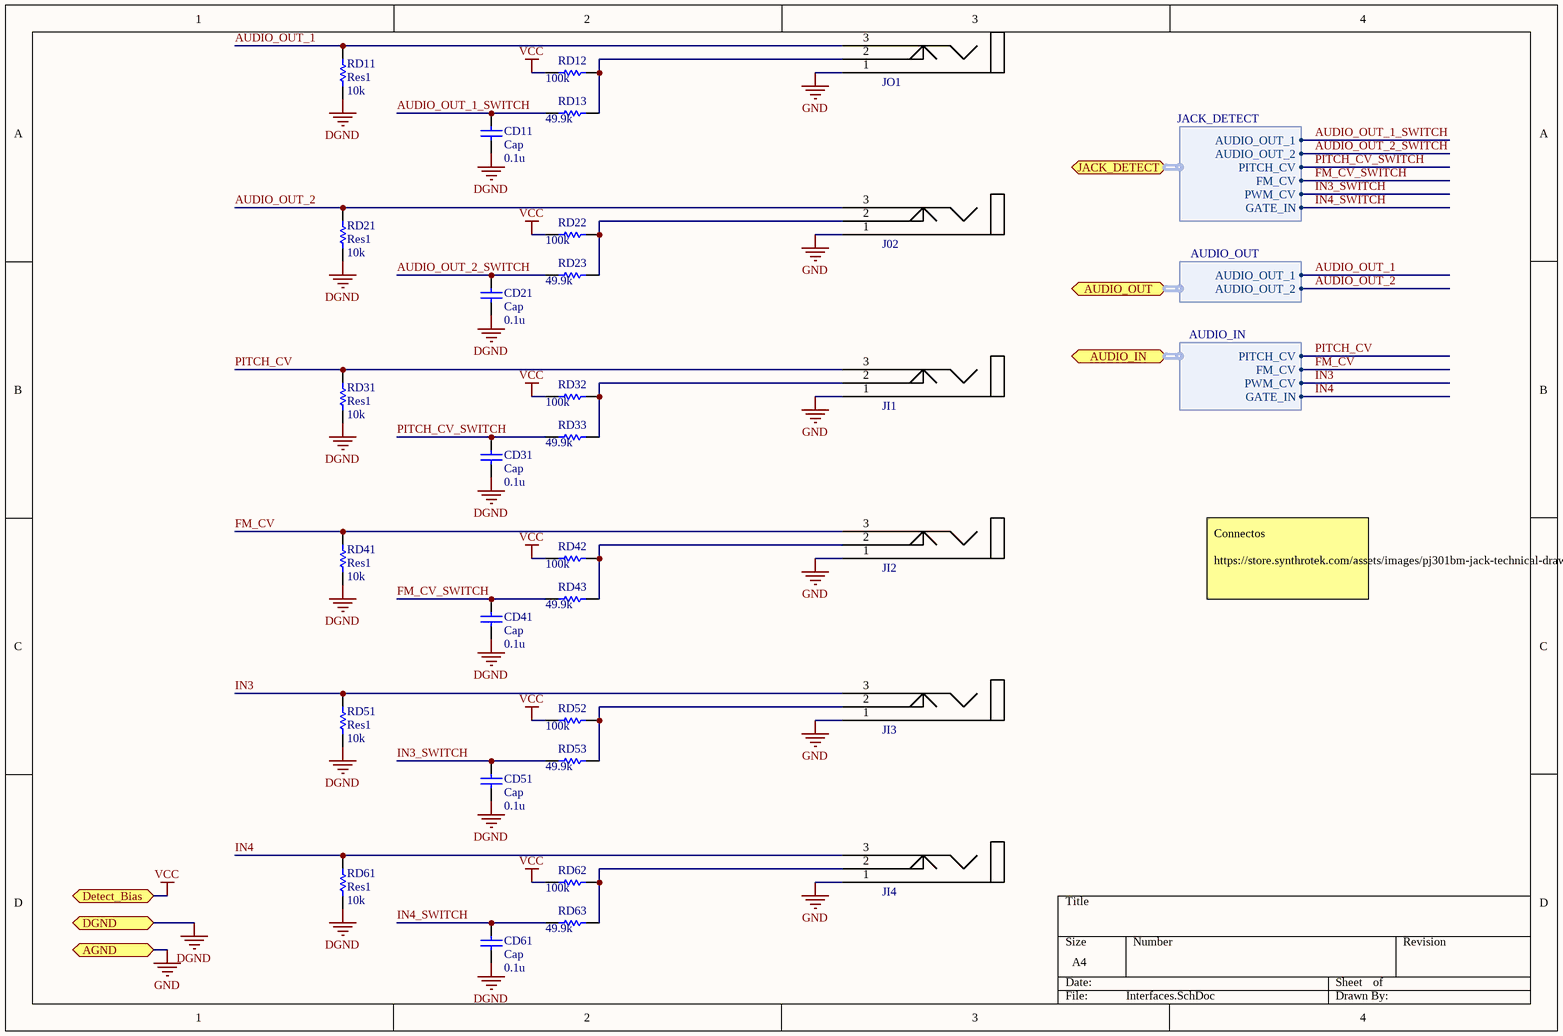
[diagram p7: Interfaces.SchDoc]

### Parts
CD11  Cap  value 0.1u  [C 0603 / 1608]
CD21  Cap  value 0.1u  [C 0603 / 1608]
CD31  Cap  value 0.1u  [C 0603 / 1608]
CD41  Cap  value 0.1u  [C 0603 / 1608]
CD51  Cap  value 0.1u  [C 0603 / 1608]
CD61  Cap  value 0.1u  [C 0603 / 1608]
J02  PJ-301  [PJ-301]  (value not drawn)
JI1  PJ-301  [PJ-301]  (value not drawn)
JI2  PJ-301  [PJ-301]  (value not drawn)
JI3  PJ-301  [PJ-301]  (value not drawn)
JI4  PJ-301  [PJ-301]  (value not drawn)
JO1  PJ-301  [PJ-301]  (value not drawn)
RD11  Res1  value 10k  [RES0603R]
RD12  value 100k  [RES0603R]  (hidden comment: Res1)
RD13  value 49.9k  [RES0603R]  (hidden comment: Res1)
RD21  Res1  value 10k  [RES0603R]
RD22  value 100k  [RES0603R]  (hidden comment: Res1)
RD23  value 49.9k  [RES0603R]  (hidden comment: Res1)
RD31  Res1  value 10k  [RES0603R]
RD32  value 100k  [RES0603R]  (hidden comment: Res1)
RD33  value 49.9k  [RES0603R]  (hidden comment: Res1)
RD41  Res1  value 10k  [RES0603R]
RD42  value 100k  [RES0603R]  (hidden comment: Res1)
RD43  value 49.9k  [RES0603R]  (hidden comment: Res1)
RD51  Res1  value 10k  [RES0603R]
RD52  value 100k  [RES0603R]  (hidden comment: Res1)
RD53  value 49.9k  [RES0603R]  (hidden comment: Res1)
RD61  Res1  value 10k  [RES0603R]
RD62  value 100k  [RES0603R]  (hidden comment: Res1)
RD63  value 49.9k  [RES0603R]  (hidden comment: Res1)

### Ports
AGND (bidir), AUDIO_IN (bidir, harness AUDIO_IN), AUDIO_OUT (bidir, harness AUDIO_OUT), Detect_Bias (bidir), DGND (bidir), JACK_DETECT (bidir, harness JACK_DETECT)

### Harnesses
JACK_DETECT: AUDIO_OUT_1, AUDIO_OUT_2, PITCH_CV, FM_CV, PWM_CV, GATE_IN
AUDIO_OUT: AUDIO_OUT_1, AUDIO_OUT_2
AUDIO_IN: PITCH_CV, FM_CV, PWM_CV, GATE_IN

### Nets
DGND: CD11.1 CD21.1 CD31.1 CD41.1 CD51.1 CD61.1 RD11.1 RD21.1 RD31.1 RD41.1 RD51.1 RD61.1 ; port DGND
GND: J02.1(Sleeve) JI1.1(Sleeve) JI2.1(Sleeve) JI3.1(Sleeve) JI4.1(Sleeve) JO1.1(Sleeve) ; port AGND  [project net AGND]
VCC: RD12.2 RD22.2 RD32.2 RD42.2 RD52.2 RD62.2 ; port Detect_Bias  [project net 3V3]
AUDIO_OUT_1: JO1.3(Ring) RD11.2 ; port AUDIO_OUT.AUDIO_OUT_1
AUDIO_OUT_1_SWITCH: CD11.2 RD13.2 ; port JACK_DETECT.AUDIO_OUT_1
AUDIO_OUT_2: J02.3(Ring) RD21.2 ; port AUDIO_OUT.AUDIO_OUT_2
AUDIO_OUT_2_SWITCH: CD21.2 RD23.2 ; port JACK_DETECT.AUDIO_OUT_2
FM_CV: JI2.3(Ring) RD41.2 ; port AUDIO_IN.FM_CV
FM_CV_SWITCH: CD41.2 RD43.2 ; port JACK_DETECT.FM_CV
IN3: JI3.3(Ring) RD51.2 ; port AUDIO_IN.PWM_CV
IN3_SWITCH: CD51.2 RD53.2 ; port JACK_DETECT.PWM_CV
IN4: JI4.3(Ring) RD61.2 ; port AUDIO_IN.GATE_IN  [project net GATE_IN]
IN4_SWITCH: CD61.2 RD63.2 ; port JACK_DETECT.GATE_IN  [project net GATE_IN_SWITCH]
PITCH_CV: JI1.3(Ring) RD31.2 ; port AUDIO_IN.PITCH_CV
PITCH_CV_SWITCH: CD31.2 RD33.2 ; port JACK_DETECT.PITCH_CV
NetJ02_2: J02.2(Tip) RD22.1 RD23.1
NetJI1_2: JI1.2(Tip) RD32.1 RD33.1
NetJI2_2: JI2.2(Tip) RD42.1 RD43.1
NetJI3_2: JI3.2(Tip) RD52.1 RD53.1
NetJI4_2: JI4.2(Tip) RD62.1 RD63.1
NetJO1_2: JO1.2(Tip) RD12.1 RD13.1

### Notes on the sheet
- Connectos
  https://store.synthrotek.com/assets/images/pj301bm-jack-technical-drawing.jpg

### Library data of the parts
CD11 CD21 CD31 CD41 CD51 CD61 = Cap: Capacitor; Published: 8-Jun-2000; LatestRevisionDate: 17-Jul-2002; LatestRevisionNote: Re-released for DXP Platform.; PackageReference: RAD-0.3; Publisher: Altium Limited; PackageDescription: Radial Cap, Thru-Hole; 2 Leads; 0.3 in Pin Spacing
J02 JI1-JI4 JO1 = PJ-301: https://www.snapeda.com/parts/PJ-301BM/Tayda%20Electronics/datasheet/ / https://pt.aliexpress.com/item/32841677168.html?spm=a2g03.12057483.0.0.6dda4aeaXiyjRe / https://lh3.googleusercontent.com/proxy/ZbPfZslDxdj8iWSgzh0kYZVEID9Zfc6SS9ZRHYvUB6heg4eTAyEEOQEiXlT2FamGh3ujXXQ57fTjbGyEKtdVl3hemL66LOj7ZA
RD11-RD13 RD21-RD23 RD31-RD33 RD41-RD43 RD51-RD53 RD61-RD63 = Res1: Resistor; Published: 8-Jun-2000; LatestRevisionDate: 17-Jul-2002; LatestRevisionNote: Re-released for DXP Platform.; PackageReference: AXIAL-0.3; Publisher: Altium Limited; PackageDescription: Axial Device, Thru-Hole; 2 Leads; 0.3 in Pin Spacing

## Nets that join several sheets
3V3: Power (CP3.1 CP4.2 UP1.2), Micro (17 pins), Interfaces (6 pins)
+5: Power (CP5.1 CP6.2 UP2.2), DAC (CDAC4.1 CDAC5.1 UDAC1.11), ADC (5 pins), Input_stages (RIS35.2)
+12: Power (CP2.1 LP1.1 UP1.3 UP2.3), Output_stages (COS15.2 COS25.2 UOS1.8 UOS2.8), Input_stages (*#5.4 CIS32.2)
-12: Power (CP1.2 LP2.1), Output_stages (COS16.2 COS26.2 UOS1.4 UOS2.4), Input_stages (*#5.11 CIS33.2)
AGND: VCO_TOP (NT1.2), DAC (CDAC3.1 CDAC4.2 CDAC5.2 UDAC1.12), Output_stages (10 pins), ADC (6 pins), Input_stages (10 pins), Interfaces (6 pins)
DGND: VCO_TOP (NT2.2), Micro (31 pins), ADC (UADC1.7)
GND: VCO_TOP (NT1.1 NT2.1), Power (14 pins)
ADC_CLK: Micro (UM1.21), ADC (UADC1.11)
ADC_CS: Micro (UM1.24), ADC (UADC1.8)
ADC_MISO: Micro (UM1.22), ADC (UADC1.10)
ADC_MOSI: Micro (UM1.23), ADC (UADC1.9)
AUDIO_OUT_1: Output_stages (ROS16.2 ROS17.2), Interfaces (JO1.3 RD11.2)
AUDIO_OUT_1_SWITCH: Micro (UM1.57), Interfaces (CD11.2 RD13.2)
AUDIO_OUT_2: Output_stages (ROS26.2 ROS27.2), Interfaces (J02.3 RD21.2)
AUDIO_OUT_2_SWITCH: Micro (UM1.54), Interfaces (CD21.2 RD23.2)
DAC_CLK: Micro (UM1.37), DAC (RDAC1:4.5)
DAC_DEMP0: Micro (UM1.39), DAC (UDAC1.2)
DAC_DEMP1: Micro (UM1.38), DAC (UDAC1.3)
DAC_FORMAT: Micro (UM1.40), DAC (UDAC1.1)
FM_CV: Input_stages (RIS31.1), Interfaces (JI2.3 RD41.2)
FM_CV_OUT: ADC (UADC1.3), Input_stages (*?#2.7 CIS31.2 RIS34.2)
FM_CV_SWITCH: Micro (UM1.59), Interfaces (CD41.2 RD43.2)
GATE_IN: Input_stages (RIS41.1), Interfaces (JI4.3 RD61.2)
GATE_IN_OUT: ADC (UADC1.1), Input_stages (RIS42.1 RIS43.2)
GATE_IN_SWITCH: Micro (UM1.62), Interfaces (CD61.2 RD63.2)
I2S2_CK: Micro (UM1.34), DAC (RDAC1:4.7)
I2S2_SD: Micro (UM1.36), DAC (RDAC1:4.6)
I2S2_WS: Micro (UM1.33), DAC (RDAC1:4.8)
IN3: Input_stages (RIS21.1), Interfaces (JI3.3 RD51.2)
IN3_SWITCH: Micro (UM1.61), Interfaces (CD51.2 RD53.2)
NetCDAC1_2: DAC (CDAC1.2), Output_stages (ROS11.1)
NetCDAC2_2: DAC (CDAC2.2), Output_stages (ROS21.1)
PITCH_CV: Input_stages (RIS11.1), Interfaces (JI1.3 RD31.2)
PITCH_CV_OUT: ADC (UADC1.4), Input_stages (*#2.7 CIS11.2 RIS14.2)
PITCH_CV_SWITCH: Micro (UM1.58), Interfaces (CD31.2 RD33.2)
PWM_CV_OUT: ADC (UADC1.2), Input_stages (*#4.14 CIS21.2 RIS24.2)